# Altium schematic sheet AAS_module_Touch-rev1_2.SchDoc: Touch controller
size A4; Author: Richard Kubíček; DocumentNumber: 3; SheetNumber: 3; SheetTotal: 4; PageSize: A4; DruhPraceRadek1: Diplomová; DruhPraceRadek2: práce
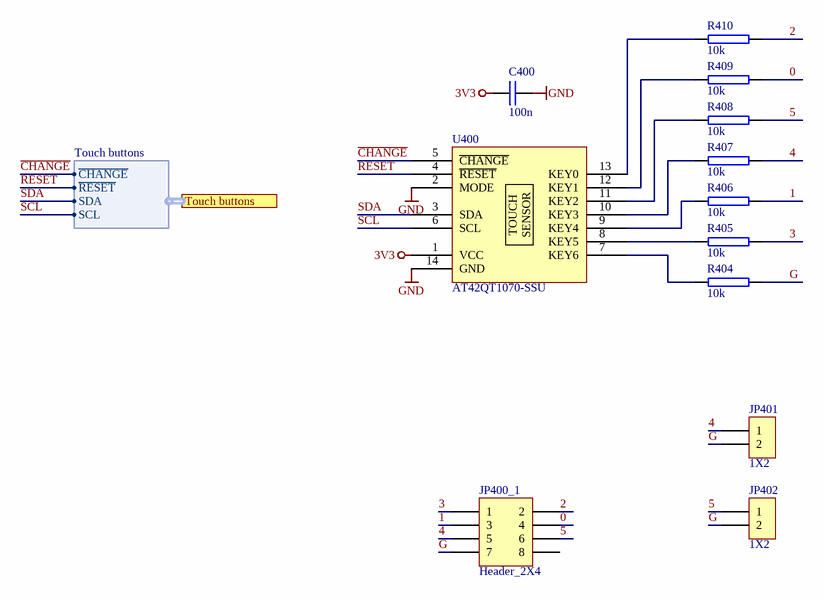
[diagram p0: AAS_module_Touch-rev1_2.SchDoc]

## Parts
C400  100n  [C0603]
JP400_1  Header_2X4  [HDR2X4]
JP401  1X2  [HDR1X2]
JP402  1X2  [HDR1X2]
R404  10k  [R0603]
R405  10k  [R0603]
R406  10k  [R0603]
R407  10k  [R0603]
R408  10k  [R0603]
R409  10k  [R0603]
R410  10k  [R0603]
U400  AT42QT1070-SSU  [SO-14]

## Ports
Touch buttons (harness Touch buttons)

## Harnesses
Touch buttons: ~{CHANGE}, ~{RESET}, SDA, SCL

## Nets
3V3: C400.1 U400.1(VCC)
GND: C400.2 U400.2(MODE) U400.14(GND)
0: JP400_1.4 R409.2
1: JP400_1.3 R406.2
2: JP400_1.2 R410.2
3: JP400_1.1 R405.2
4: JP400_1.5 JP401.1 R407.2
5: JP400_1.6 JP402.1 R408.2
~{CHANGE}: U400.5(~{CHANGE}) ; port Touch buttons.~{CHANGE}
G: JP400_1.7 JP401.2 JP402.2 R404.2
~{RESET}: U400.4(~{RESET}) ; port Touch buttons.~{RESET}
SCL: U400.6(SCL) ; port Touch buttons.SCL
SDA: U400.3(SDA) ; port Touch buttons.SDA
NetR404_1: R404.1 U400.7(KEY6)
NetR405_1: R405.1 U400.8(KEY5)
NetR406_1: R406.1 U400.9(KEY4)
NetR407_1: R407.1 U400.10(KEY3)
NetR408_1: R408.1 U400.11(KEY2)
NetR409_1: R409.1 U400.12(KEY1)
NetR410_1: R410.1 U400.13(KEY0)

Not connected (* = marked no-connect by the designer): JP400_1 8

## Notes on the sheet
- Druh práce
- Název dokumentu
- Projekt
- Autor
- Revize
- Strana
- (in symbol AT42QT1070-SSU) TOUCH; SENSOR

## Library data of the parts
C400 = C_0603: Capacitor SMD 0603
JP400_1 = 19: Header dual row; ID: 19; UR: 0,1; ABRA number: 120430; Value: Header_2X4; Technology: THT
JP401 JP402 = Header 1X2: Header, 2-Pin, Single row
R404-R410 = R_0603: Resistor SMD 0603
U400 = AT42QT1070-SSU: Seven-channel QTouch® Touch Sensor IC